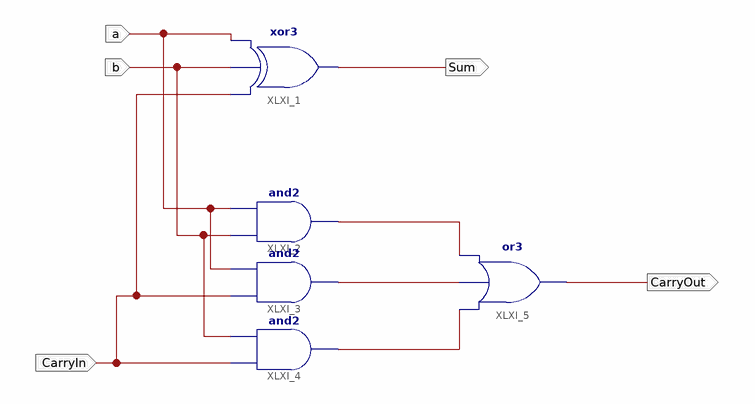
[diagram p0: schematic sheet 1]
// Xilinx ISE schematic full_adder.sch (spartan6) as structural Verilog: 5 symbols, 5 ports
module full_adder (
  input  a,
  input  b,
  input  CarryIn,
  output Sum,
  output CarryOut
);

  wire XLXN_16, XLXN_17, XLXN_18;

  xor XLXI_1 (Sum, CarryIn, b, a);
  and XLXI_2 (XLXN_16, b, a);
  and XLXI_3 (XLXN_17, CarryIn, a);
  and XLXI_4 (XLXN_18, CarryIn, b);
  or XLXI_5 (CarryOut, XLXN_18, XLXN_17, XLXN_16);
endmodule
